# EAGLE design WT12-Teensy3.1 (EAGLE 6.3)
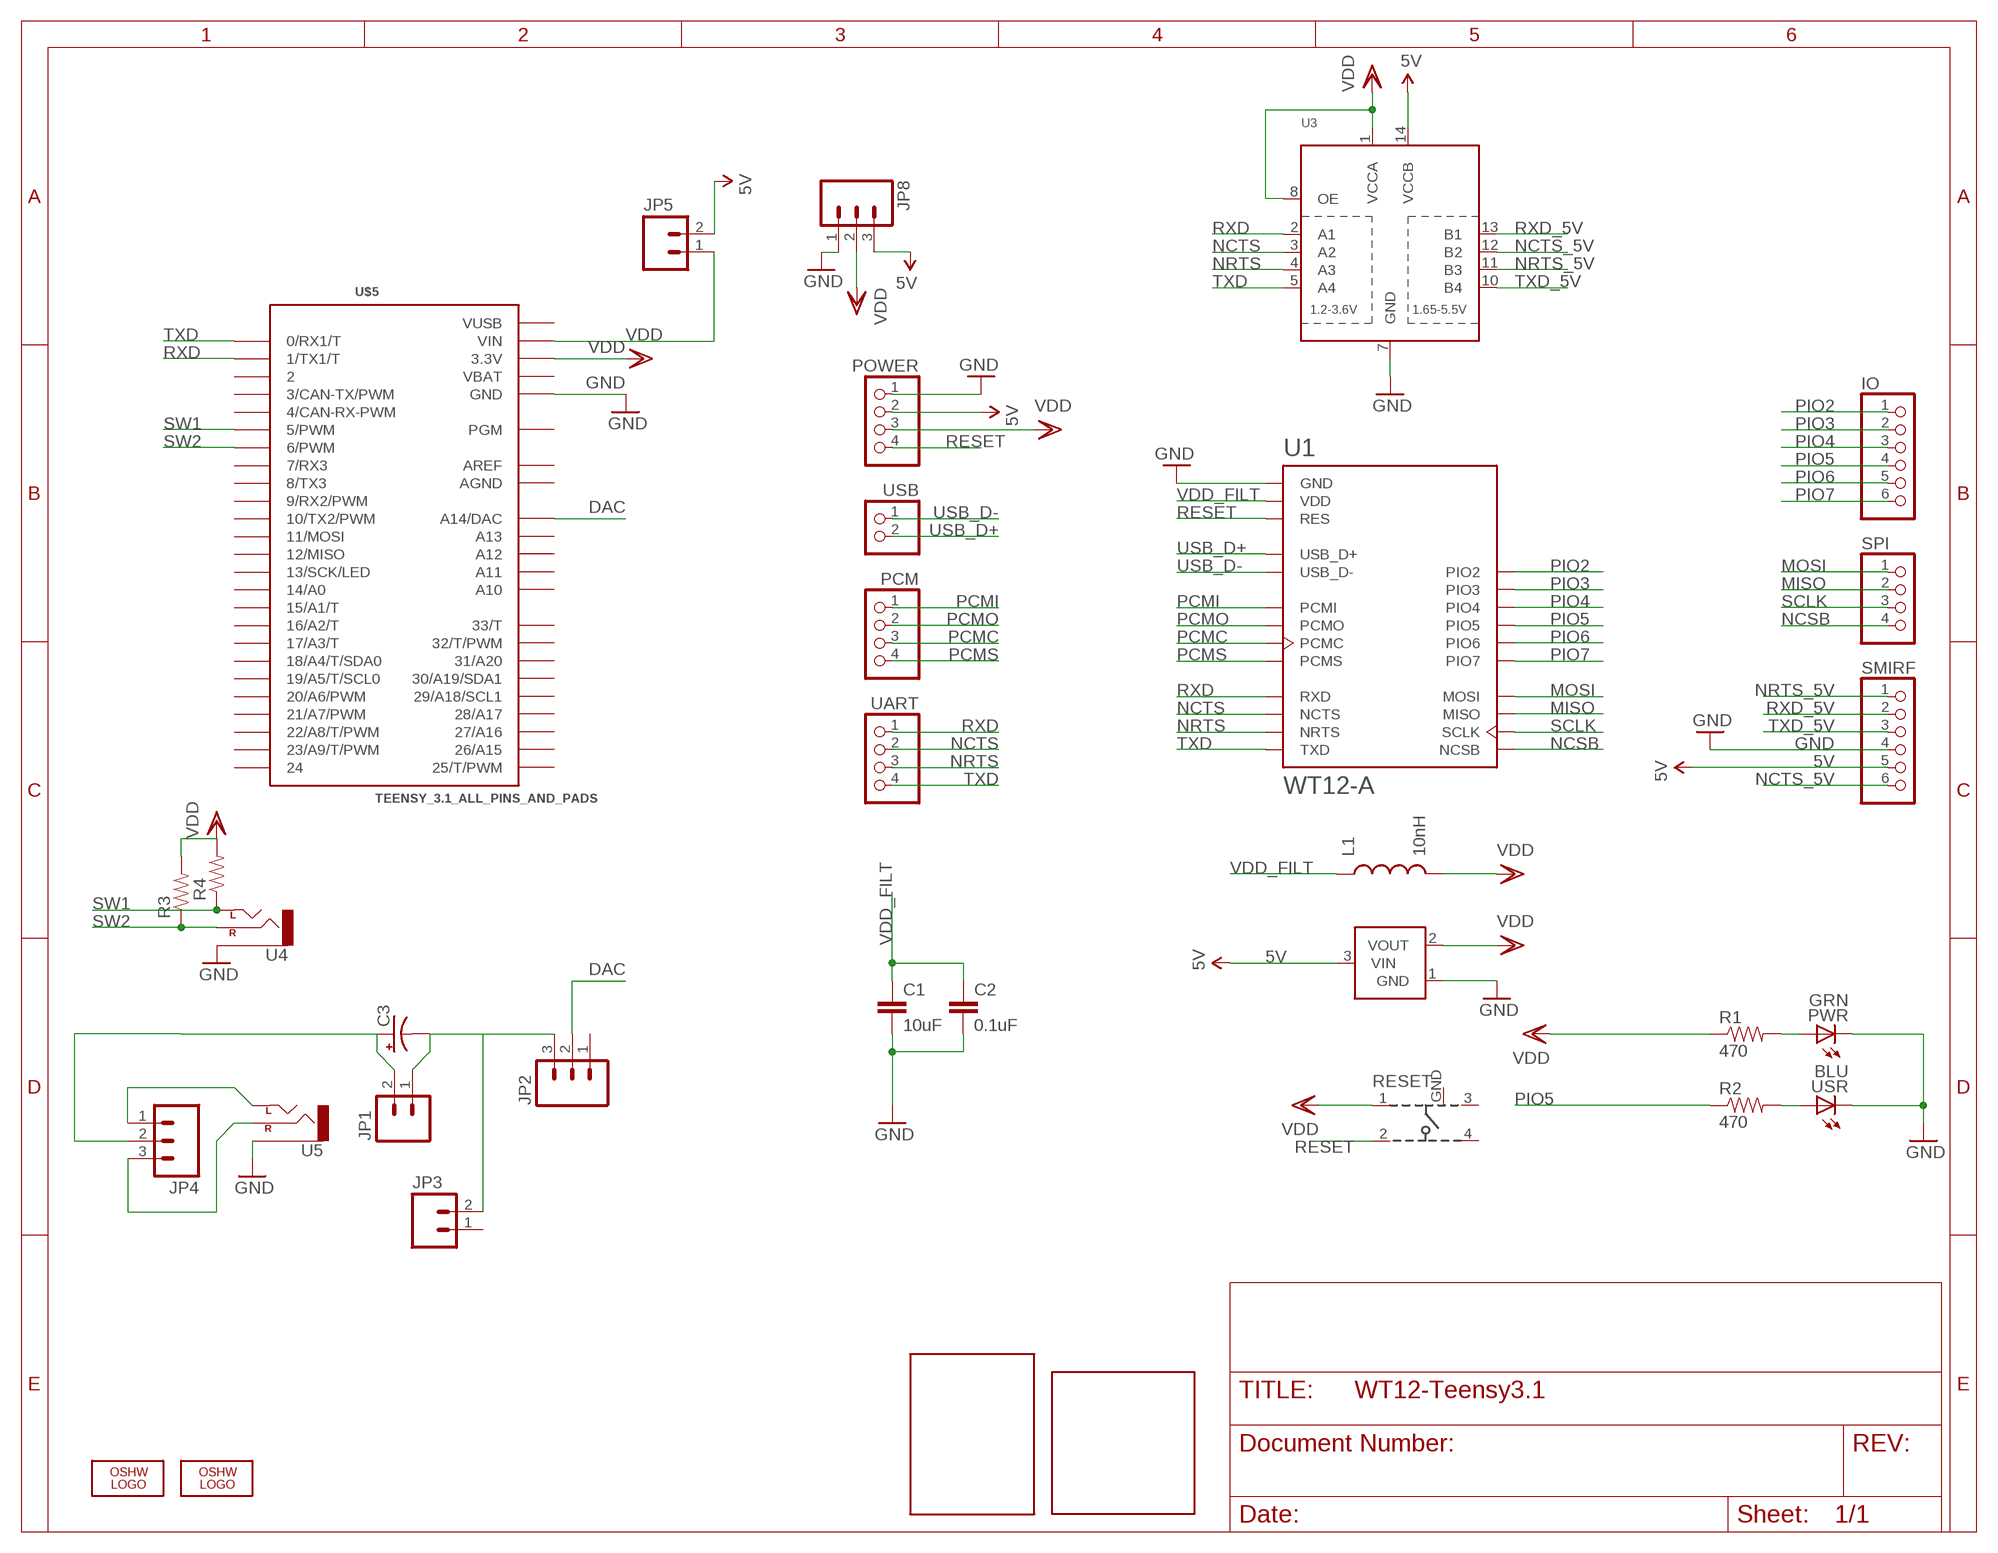
[diagram p0: schematic, sheet 1]

## Parts
C1  10uF  CAP0603-CAP  [0603-CAP]
C2  0.1uF  CAP0603-CAP  [0603-CAP]
C3  CAP_POLPTH1  [CPOL-RADIAL-100UF-25V]
IO  PINHD-1X6  [1X06]
JP1  M02PTH  [1X02]
JP2  M03PTH  [1X03]
JP3  M02PTH  [1X02]
JP4  M03PTH  [1X03]
JP5  M02PTH  [1X02]
JP8  M03PTH  [1X03]
L1  10nH  INDUCTOR0603  [0603]
LOGO1  OSHW_LOGO_FILLX0070-NT  [OSHW_FILLX70_NOTEXT]
LOGO3  OSHW_LOGO_FILLX0070-NT  [OSHW_FILLX70_NOTEXT]
PCM  PINHD-1X4  [1X04]
POWER  PINHD-1X4  [1X04]
PWR  GRN  LEDCHIPLED_0805  [CHIPLED_0805]
R1  470  RESISTOR0603-RES  [0603-RES]
R2  470  RESISTOR0603-RES  [0603-RES]
R3  RESISTOR0603-RES  [0603-RES]
R4  RESISTOR0603-RES  [0603-RES]
RESET  101-IG  [101-IG]
SMIRF  PINHD-1X6  [1X06]
SPI  PINHD-1X4  [1X04]
U1  WT12-A  [WT12-A]
U2  MCP1700  [SOT23-3]
U3  TXB0104PWR  [TSSOP14]
U4  AUDIO-JACKPTH  [AUDIO-JACK]
U5  AUDIO-JACKPTH  [AUDIO-JACK]
U$2  PROTOAREA5X6  [PROTOAREA5X6]
U$5  TEENSY_3.1_ALL_PINS_AND_PADS  [TEENSY_3.1_ALLPINS]
U$6  PROTOAREA  [PROTOAREA]
UART  PINHD-1X4  [1X04]
USB  PINHD-1X2  [1X02]
USR  BLU  LEDCHIPLED_0805  [CHIPLED_0805]

## Nets
5V [power]: JP5.2 JP8.3 POWER.2 SMIRF.5 U2.3(VIN) U3.14(VCCB)
DAC: JP2.2 U$5.A14(A14/DAC)
GND [power]: C1.2 C2.2 JP8.1 POWER.1 PWR.C SMIRF.4 U1.GND U1.GND@2(GND) U1.GND@3(GND) U1.GND@4(GND) U2.1(GND) U3.7(GND) U4.SLEEVE U5.SLEEVE U$5.GND U$5.GND1(GND) U$5.GND2(GND) USR.C
MISO: SPI.2 U1.MISO
MOSI: SPI.1 U1.MOSI
N$1: PWR.A R1.2
N$2: C3.2(-) JP1.1 JP2.3 JP3.2
N$3: R2.2 USR.A
N$4: JP4.1 U5.TIP(LEFT)
N$5: C3.1(+) JP1.2 JP4.2
N$6: JP4.3 U5.RING(RIGHT)
N$7: JP5.1 U$5.VIN
NCSB: SPI.4 U1.NCSB
NCTS: U1.NCTS U3.3(A2) UART.2
NCTS_5V: SMIRF.6 U3.12(B2)
NRTS: U1.NRTS U3.4(A3) UART.3
NRTS_5V: SMIRF.1 U3.11(B3)
PCMC: PCM.3 U1.PCMC
PCMI: PCM.1 U1.PCMI
PCMO: PCM.2 U1.PCMO
PCMS: PCM.4 U1.PCMS
PIO2: IO.1 U1.PIO2
PIO3: IO.2 U1.PIO3
PIO4: IO.3 U1.PIO4
PIO5: IO.4 R2.1 U1.PIO5
PIO6: IO.5 U1.PIO6
PIO7: IO.6 U1.PIO7
RESET: POWER.4 RESET.2 U1.RES
RXD: U1.RXD U3.2(A1) U$5.1(1/TX1/T) UART.1
RXD_5V: SMIRF.2 U3.13(B1)
SCLK: SPI.3 U1.SCLK
SW1: R4.1 U4.TIP(LEFT) U$5.5(5/PWM)
SW2: R3.1 U4.RING(RIGHT) U$5.6(6/PWM)
TXD: U1.TXD U3.5(A4) U$5.0(0/RX1/T) UART.4
TXD_5V: SMIRF.3 U3.10(B4)
USB_D+: U1.USB_D+ USB.2
USB_D-: U1.USB_D- USB.1
VDD [power]: JP8.2 L1.2 POWER.3 R1.1 R3.2 R4.2 RESET.1 U2.2(VOUT) U3.1(VCCA) U3.8(OE) U$5.3.3V U$5.3.3V1(3.3V) U$5.3.3V2(3.3V)
VDD_FILT [power]: C1.1 C2.1 L1.1 U1.VDD U1.VDD@2(VDD)
Unconnected: JP2.1 JP3.1 RESET.3 RESET.4 U$5.2 U$5.3(3/CAN-TX/PWM) U$5.4(4/CAN-RX-PWM) U$5.7(7/RX3) U$5.8(8/TX3) U$5.9(9/RX2/PWM) U$5.10(10/TX2/PWM) U$5.11(11/MOSI) U$5.12(12/MISO) U$5.13(13/SCK/LED) U$5.14/A0 U$5.15/A1(15/A1/T) U$5.16/A2(16/A2/T) U$5.17/A3(17/A3/T) U$5.18/A4(18/A4/T/SDA0) U$5.19/A5(19/A5/T/SCL0) U$5.20/A6(20/A6/PWM) U$5.21/A7(21/A7/PWM) U$5.22/A8(22/A8/T/PWM) U$5.23/A9(23/A9/T/PWM) U$5.24 U$5.25(25/T/PWM) U$5.26(26/A15) U$5.27(27/A16) U$5.28(28/A17) U$5.29(29/A18/SCL1) U$5.30(30/A19/SDA1) U$5.31(31/A20) U$5.32(32/T/PWM) U$5.33(33/T) U$5.A10 U$5.A11 U$5.A12 U$5.A13 U$5.PGM

## Power pins joined to a net without a drawn wire
AGND: U$5.AGND
AREF: U$5.AREF
GND: RESET.GND
VBAT: U$5.VBAT
VUSB: U$5.VUSB

## Library data of the parts
C1 C2 = SparkFun:CAP: Capacitor Standard 0603 ceramic capacitor, and 0.1" leaded capacitor.
C3 = SparkFun-Capacitors:CAP_POL: Capacitor Polarized These are standard SMD and PTH capacitors. Normally 10uF, 47uF, and 100uF in electrolytic and tantalum varieties. Always verify the external diameter of the through hole cap, it varies with capacity, voltage, and manufacturer. The EIA devices should be standard.
IO SMIRF = sf-pinhead:PINHD-1X6: PIN HEADER
JP1 JP3 JP5 = SparkFun-Connectors:M02: Header 2 Standard 2-pin 0.1" header. Use with straight break away headers (SKU : PRT-00116), right angle break away headers (PRT-00553), swiss pins (PRT-00743), machine pins (PRT-00117), and female headers (PRT-00115). Molex polarized connector foot print use with SKU : PRT-08233 with associated crimp pins and housings.
JP2 JP4 JP8 = SparkFun-Connectors:M03: Header 3 Standard 3-pin 0.1" header. Use with straight break away headers (SKU : PRT-00116), right angle break away headers (PRT-00553), swiss pins (PRT-00743), machine pins (PRT-00117), and female headers (PRT-00115). Molex polarized connector foot print use with SKU : PRT-08232 with associated crimp pins and housings.
L1 = SparkFun:INDUCTOR: Inductors Basic Inductor/Choke - 0603 and 1206. Footprints are not proven and vary greatly between part numbers.
LOGO1 LOGO3 = oshw-logo:OSHW_LOGO_FILL
PCM POWER SPI UART = sf-pinhead:PINHD-1X4: PIN HEADER
PWR USR = adafruit:LED: LED OSRAM: - CHIPLED LG R971, LG N971, LY N971, LG Q971, LY Q971, LO R971, LY R971 LH N974, LH R974 LS Q976, LO Q976, LY Q976 LO Q996 - Hyper CHIPLED LW Q18S LB Q993, LB Q99A, LB R99A - SideLED LS A670, LO A670, LY A670, LG A670, LP A670 LB A673, LV A673, LT A673, LW A673 LH A674 LY A675 LS A676, LA A676, LO A676, LY A676, LW A676 LS A679, LY A679, LG A679 - Hyper Micro SIDELED® LS Y876, LA Y876, LO Y876, LY Y876 LT Y87S - SmartLED LW L88C, LW L88S LB L89C, LB L89S, LG L890 LS L89K, LO L89K, LY L89K LS L896, LA L896, LO L896, LY L896 - TOPLED LS T670, LO T670, LY T670, LG T670, LP T670 LSG T670, LSP T670, LSY T670, LOP T670, LYG T670 LG T671, LOG T671, LSG T671 LB T673, LV T673, LT T673, LW T673 LH T674 LS T676, LA T676, LO T676, LY T676, LB T676, LH T676, LSB T676, LW T676 LB T67C, LV T67C, LT T67C, LS T67K, LO T67K, LY T67K, LW E67C LS E67B, LA E67B, LO E67B, LY E67B, LB E67C, LV E67C, LT E67C LW T67C LS T679, LY T679, LG T679 LS T770, LO T770, LY T770, LG T770, LP T770 LB T773, LV T773, LT T773, LW T773 LH T774 LS E675, LA E675, LY E675, LS T675 LS T776, LA T776, LO T776, LY T776, LB T776 LHGB T686 LT T68C, LB T68C - Hyper Mini TOPLED® LB M676 - Mini TOPLED Santana® LG M470 LS M47K, LO M47K, LY M47K Source: http://www.osram.convergy.de/
R1 R2 = SparkFun:RESISTOR: Resistor Basic schematic elements and footprints for 0603, 1206, and PTH resistors.
R3 R4 = SparkFun-Passives:RESISTOR: Resistor Basic schematic elements and footprints for 0603, 1206, and PTH resistors.
RESET = sf-keyglove:101-IG
U1 = sf-bluegiga:WT12: Bluegiga WT12 class 2 Bluetooth 2.1 + EDR module. WT12-A variant has an on-module ceramic chip antenna. WT12-A variant includes keepout/restrict area. Antenna edge of the module should be flush up against the edge of the PCB. See datasheet for variant layout details. The WT12 is a fully integrated Bluetooth 2.1 + EDR, class 2 module combining antenna, Bluetooth radio, and an on-board iWRAP Bluetooth stack. Bluegiga's WT12 constitutes the ideal solution for developers that want to quickly integrate Bluetooth wireless technology into their design without investing several months in Bluetooth radio and stack development. It uses Bluegiga's iWRAP Bluetooth stack, which is an embedded Bluetooth stack implementing 13 different Bluetooth profiles and Apple iAP connectivity. The WT12 combined with iWRAP Bluetooth stack and Bluegiga's excellent technical support designers ensure quick time-to-market and low development costs and risks. http://www.bluegiga.com/en-US/products/bluetooth-classic-modules/wt12-bluetooth--class-2-module https://github.com/jrowberg/sf-oshw Last updated 2014-01-04 by Jeff Rowberg <jeff@rowberg.net>; ANTENNA: On-module ceramic chip antenna
U2 = nonolith:MCP1700: Voltage regulator
U3 = SparkFun-DigitalIC:TXB0104PWR: 4-Bit Bi-Directional Level Shifter 1.2V-3.6V (VCCA) to 1.65V-5.5V (VCCB) bi-directional level shifter with auto direction sensing. Max data rate - VCCA 1.8V: 20Mbps (50ns), VCCA 3.3V: 100Mbps (10ns) Digikey: 296-21929-1-ND (TSSOP) IC-11329
U4 U5 = SparkFun-Connectors:AUDIO-JACK: 3.5mm Audio Jack Simple 3.5mm common PCB mount audio jack. SKU: PRT-08032
U$2 = zunkworks:PROTOAREA5X6
U$5 = Teensy_3_Series_Board_v1.0:TEENSY_3.1_ALL_PINS_AND_PADS: Footprint for Teensy 3.1 board using all pads and all through-holes. Pads need a 2x7 0.1" SMD header.
U$6 = zunkworks:PROTOAREA
USB = sf-pinhead:PINHD-1X2: PIN HEADER

## Net classes
0 default: width 0.152 mm, drill 0.33 mm, clearance 0.152 mm
1 power: width 0.254 mm, drill 0.33 mm, clearance 0.152 mm

## Board
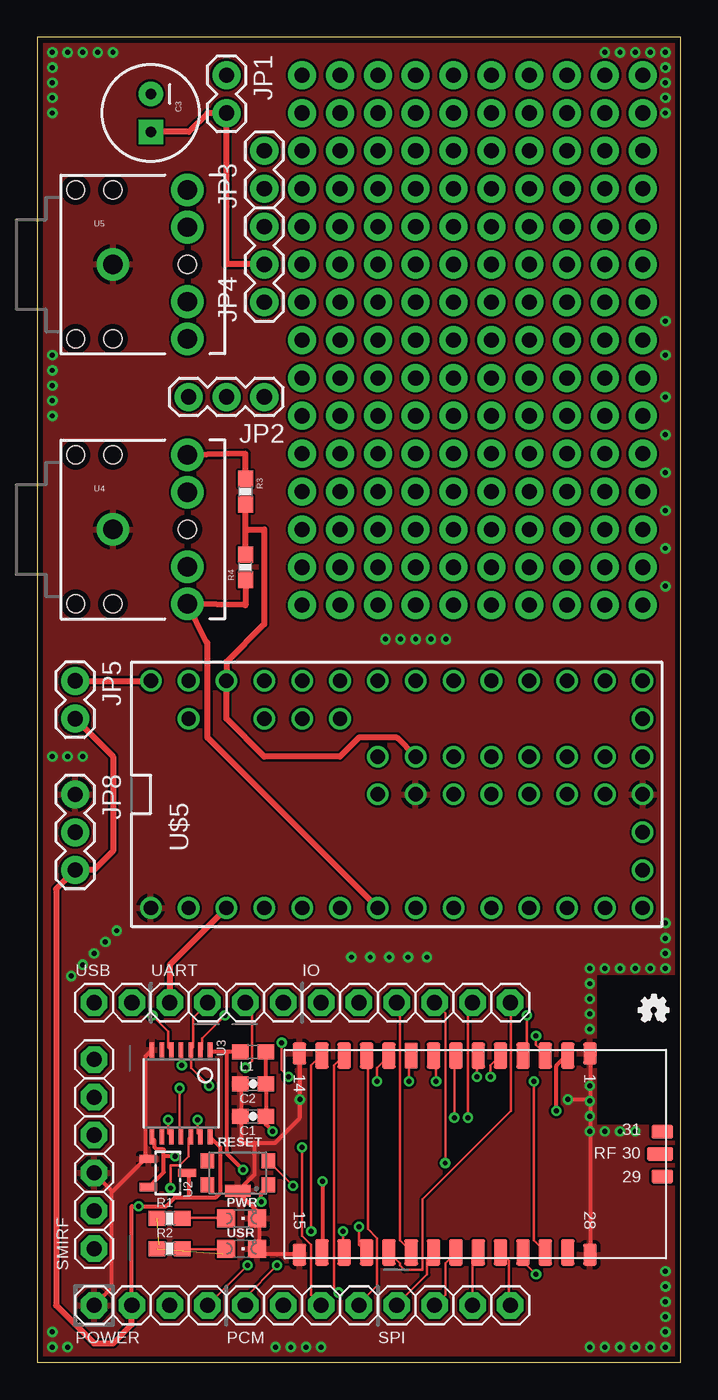
[diagram p1: board, top side]
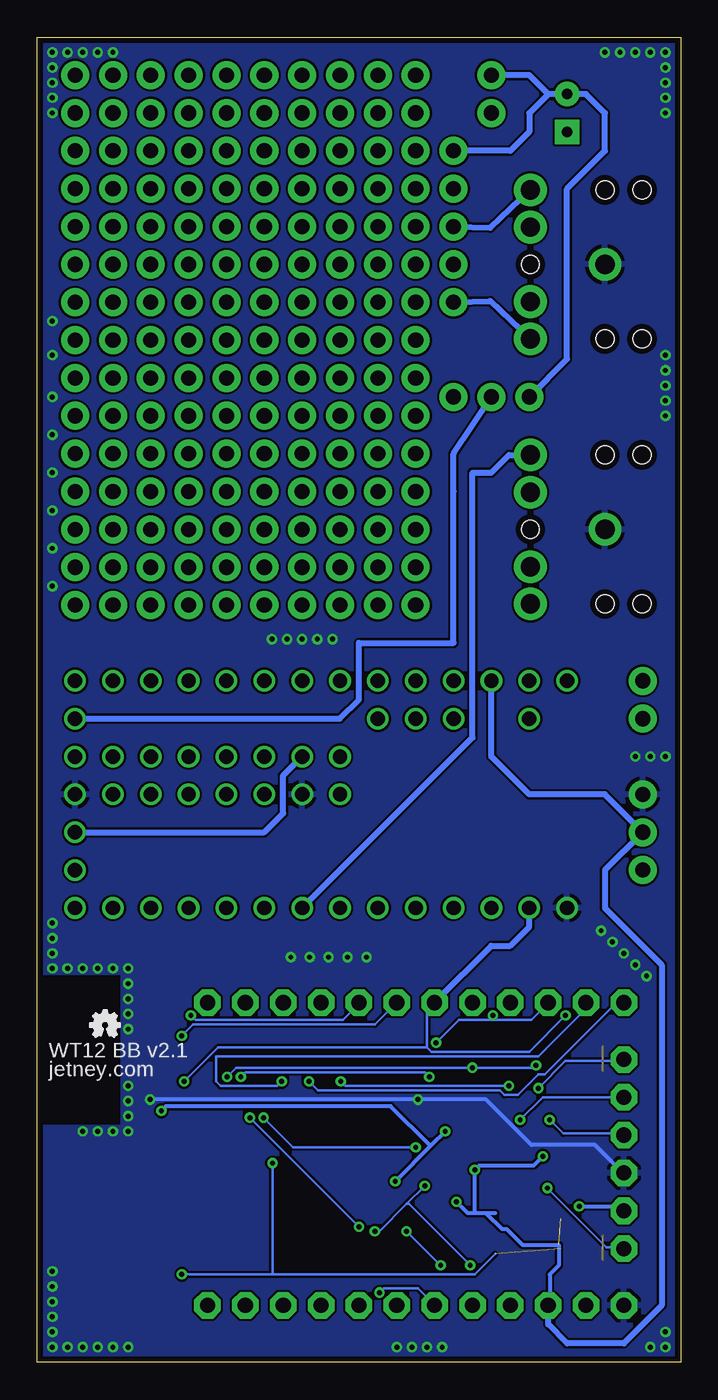
[diagram p2: board, bottom side, seen from below]

Size 43.18 x 88.9 mm. Coordinates in mm from the lower left corner, seen from the top.
Outline: 0,0 43.18,0 43.18,88.9 0,88.9 0,0
Copper layers (1*16): Top 0.0356mm / dielectric 1.5011mm / Bottom 0.0356mm
Design rules "LaenPCBOrder": minimum track width 6mil, minimum drill 13mil, track to track 6mil, track to pad 6mil, pad to pad 6mil, via to via 6mil, smd to smd 6mil, copper to edge 15mil, drill to drill 6mil, minimum pad ring 7mil, minimum via ring 7mil, stop-mask expansion 3mil, vias tented up to drill 0mil, thermal gap 10mil
vRestrict: area 2.5,21.8 to 33,22.9; area 2.5,5.1 to 33,6.1; area 5.1,6.3 to 6.3,21.6; area 12.7,8.4 to 14.2,8.9; area 12.7,10.4 to 14.2,10.9

### Footprints (pad centres in the part's own frame; a part is rotated, then mirrored left to right if it is on the bottom)
0603-CAP = smd 1.1 x 1: 1 -0.85,0; 2 0.85,0
CPOL-RADIAL-100UF-25V = drill 0.7 pad 1.651 square: 1 1.27,0 | drill 0.7 pad 1.651: 2 -1.27,0
1X06 = drill 1.016 pad 1.778 octagon: 1 -6.35,0; 2 -3.81,0; 3 -1.27,0; 4 1.27,0; 5 3.81,0; 6 6.35,0
1X02 = drill 1.016 pad 1.88: 1 0,0; 2 2.54,0
1X03 = drill 1.016 pad 1.88: 1 0,0; 2 2.54,0; 3 5.08,0
0603 = smd 1.1 x 1: 1 -0.85,0; 2 0.85,0
1X04 = drill 1.016 pad 1.778 octagon: 1 -3.81,0; 2 -1.27,0; 3 1.27,0; 4 3.81,0
CHIPLED_0805 = smd 1.2 x 1.2: A 0,-1.05; C 0,1.05
0603-RES = smd 1.1 x 1: 1 -0.85,0; 2 0.85,0
101-IG = smd 0.9 x 1: 1 -2.05,0.8; 2 -2.05,-0.8; 3 2.05,0.8; 4 2.05,-0.8 | smd 1.7 x 0.8: GND 0,1.2
WT12-A = smd 1.478 x 0.914: GND -6.75,7.7; GND@2 -6.75,-11.8; GND@3 6.75,-11.8; GND@4 6.75,7.7 | smd 1.778 x 0.914: MISO 6.6,0.2; MOSI 6.6,1.7; NC 6.6,6.2; NCSB 6.6,-2.8; NCTS -6.6,-5.8; NRTS -6.6,1.7; PCMC -6.6,-8.8; PCMI -6.6,-7.3; PCMO -6.6,-1.3; PCMS -6.6,-10.3; PIO2 -6.6,4.7; PIO3 -6.6,3.2; PIO4 6.6,-4.3; PIO5 6.6,3.2; PIO6 6.6,-7.3; PIO7 6.6,-5.8; RES 6.6,-8.8; RXD -6.6,0.2; SCLK 6.6,-1.3; TXD 6.6,4.7; USB_D+ -6.6,-2.8; USB_D- -6.6,-4.3; VDD -6.6,6.2; VDD@2 6.6,-10.3 | smd 0.914 x 1.778: RF 0,12.4 | smd 0.914 x 1.478: RFGND 1.5,12.55; RFGND@2 -1.5,12.55
SOT23-3 = smd 0.55 x 1.2: 1 0.95,1.3; 2 -0.95,1.3; 3 0,-1.3
TSSOP14 = smd 0.305 x 0.991: 1 -1.95,-2.918; 2 -1.3,-2.918; 3 -0.65,-2.918; 4 0,-2.918; 5 0.65,-2.918; 6 1.3,-2.918; 7 1.95,-2.918; 8 1.95,2.918; 9 1.3,2.918; 10 0.65,2.918; 11 0,2.918; 12 -0.65,2.918; 13 -1.3,2.918; 14 -1.95,2.918
AUDIO-JACK = drill 1.3 pad 2.184: RING 5,5; RSH 5,2.5; SLEEVE 0,0; TIP 5,-5; TSH 5,-2.5 | hole 1.2: 0,5; -2.5,5; -2.5,-5; 0,-5; 5,0
PROTOAREA5X6 = drill 1.016 pad 1.88: P$1 -2.54,1.27; P$2 -5.08,1.27; P$3 -2.54,11.43; P$4 -5.08,11.43; P$5 0,1.27; P$6 0,-1.27; P$7 -2.54,-1.27; P$8 -5.08,-1.27; P$9 0,11.43; P$10 0,8.89; P$11 -2.54,8.89; P$12 -5.08,8.89; P$13 -5.08,-3.81; P$14 -2.54,-3.81; P$15 0,-3.81; P$16 0,-6.35; P$17 -2.54,-6.35; P$18 -5.08,-6.35; P$19 -5.08,6.35; P$20 -2.54,6.35; P$21 0,6.35; P$22 0,3.81; P$23 -2.54,3.81; P$24 -5.08,3.81; P$25 2.54,11.43; P$26 2.54,8.89; P$27 2.54,6.35; P$28 2.54,1.27; P$29 2.54,-1.27; P$30 2.54,-3.81; P$31 2.54,-6.35; P$32 2.54,-8.89; P$33 0,-8.89; P$34 -2.54,-8.89; P$35 -5.08,-8.89; P$36 2.54,3.81; P$37 5.08,11.43; P$38 5.08,8.89; P$39 5.08,6.35; P$40 5.08,3.81; P$53 5.08,1.27; P$54 5.08,-1.27; P$55 5.08,-3.81; P$56 5.08,-6.35; P$57 5.08,-8.89; P$58 5.08,-11.43; P$59 2.54,-11.43; P$60 0,-11.43; P$61 -2.54,-11.43; P$62 -5.08,-11.43
TEENSY_3.1_ALLPINS = drill 0.965: 0 -7.62,15.24; 1 -7.62,12.7; 2 -7.62,10.16; 3 -7.62,7.62; 3.3V 7.62,12.7; 3.3V1 -2.54,-15.24; 3.3V2 2.54,0; 4 -7.62,5.08; 5 -7.62,2.54; 6 -7.62,0; 7 -7.62,-2.54; 8 -7.62,-5.08; 9 -7.62,-7.62; 10 -7.62,-10.16; 11 -7.62,-12.7; 12 -7.62,-15.24; 13 7.62,-15.24; 14/A0 7.62,-12.7; 15/A1 7.62,-10.16; 16/A2 7.62,-7.62; 17/A3 7.62,-5.08; 18/A4 7.62,-2.54; 19/A5 7.62,0; 20/A6 7.62,2.54; 21/A7 7.62,5.08; 22/A8 7.62,7.62; 23/A9 7.62,10.16; 24 0,-2.54; 25 0,-5.08; 26 0,-7.62; 27 0,-10.16; 28 0,-12.7; 29 2.54,-12.7; 30 2.54,-10.16; 31 2.54,-7.62; 32 2.54,-5.08; 33 2.54,-2.54; A10 5.08,7.62; A11 5.08,5.08; A12 0,2.54; A13 2.54,2.54; A14 5.08,-15.24; AGND 7.62,15.24; AREF 5.08,10.16; GND -7.62,17.78; GND1 0,-15.24; GND2 0,0; PGM 2.54,-15.24; VBAT -5.08,-15.24; VIN 7.62,17.78; VUSB 5.08,15.24
PROTOAREA = drill 1.016 pad 1.88: P$1 3.81,1.27; P$2 1.27,1.27; P$3 -1.27,1.27; P$4 -3.81,1.27; P$5 6.35,1.27; P$6 6.35,-1.27; P$7 3.81,-1.27; P$8 1.27,-1.27; P$9 -1.27,-1.27; P$10 -3.81,-1.27; P$11 -3.81,-3.81; P$12 -1.27,-3.81; P$13 1.27,-3.81; P$14 3.81,-3.81; P$15 6.35,-3.81; P$16 6.35,-6.35; P$17 3.81,-6.35; P$18 1.27,-6.35; P$19 -1.27,-6.35; P$20 -3.81,-6.35; P$21 -3.81,3.81; P$22 -1.27,3.81; P$23 1.27,3.81; P$24 3.81,3.81; P$25 6.35,3.81; P$26 8.89,6.35; P$27 8.89,3.81; P$28 8.89,1.27; P$29 8.89,-1.27; P$30 8.89,-3.81; P$31 8.89,-6.35; P$32 8.89,-8.89; P$33 6.35,-8.89; P$34 3.81,-8.89; P$35 1.27,-8.89; P$36 -1.27,-8.89; P$37 -3.81,-8.89; P$38 -6.35,-8.89; P$39 -6.35,-6.35; P$40 -6.35,-3.81; P$41 -6.35,-1.27; P$42 -6.35,1.27; P$43 -6.35,3.81; P$44 -6.35,6.35; P$45 -3.81,6.35; P$46 -1.27,6.35; P$47 1.27,6.35; P$48 3.81,6.35; P$49 6.35,6.35; P$50 11.43,8.89; P$51 11.43,6.35; P$52 11.43,3.81; P$53 11.43,1.27; P$54 11.43,-1.27; P$55 11.43,-3.81; P$56 11.43,-6.35; P$57 11.43,-8.89; P$58 11.43,-11.43; P$59 8.89,-11.43; P$60 6.35,-11.43; P$61 3.81,-11.43; P$62 1.27,-11.43; P$63 -1.27,-11.43; P$64 -3.81,-11.43; P$65 -6.35,-11.43; P$66 -8.89,-11.43; P$67 -8.89,-8.89; P$68 -8.89,-6.35; P$69 -8.89,-3.81; P$70 -8.89,-1.27; P$71 -8.89,1.27; P$72 -8.89,3.81; P$73 -8.89,6.35; P$74 -8.89,8.89; P$75 -6.35,8.89; P$76 -3.81,8.89; P$77 -1.27,8.89; P$78 1.27,8.89; P$79 3.81,8.89; P$80 6.35,8.89; P$81 8.89,8.89; P$82 11.43,11.43; P$83 -8.89,11.43; P$84 -6.35,11.43; P$85 -3.81,11.43; P$86 -1.27,11.43; P$87 1.27,11.43; P$88 3.81,11.43; P$89 6.35,11.43; P$90 8.89,11.43; P$91 -11.43,-11.43; P$92 -11.43,-8.89; P$93 -11.43,-6.35; P$94 -11.43,-3.81; P$95 -11.43,-1.27; P$96 -11.43,1.27; P$97 -11.43,3.81; P$98 -11.43,6.35; P$99 -11.43,8.89; P$100 -11.43,11.43
1X02' = drill 1.016 pad 1.778 octagon: 1 -1.27,0; 2 1.27,0

### Placement (x,y rotation side)
C1  14.48,16.51 180 top
C2  14.48,18.67 180 top
C3  7.62,83.82 270 top
IO  25.4,24.13 0 top
JP1  12.7,86.36 270 top
JP2  15.24,64.77 180 top
JP3  15.24,78.74 90 top
JP4  15.24,71.12 90 top
JP5  2.54,45.72 270 top
JP8  2.54,38.1 270 top
L1  14.48,20.83 180 top
LOGO1  40.39,22.86 0 top
LOGO3  39.62,21.84 0 bottom
PCM  17.78,3.81 180 top
POWER  7.62,3.81 0 top
PWR  13.72,9.65 270 top
R1  8.89,9.65 0 top
R2  8.89,7.62 0 top
R3  13.97,58.42 270 top
R4  13.97,53.34 90 top
RESET  13.46,12.7 180 top
SMIRF  3.81,13.97 270 top
SPI  27.94,3.81 180 top
U1  29.4,13.97 270 top
U2  8.76,12.7 90 top
U3  9.65,18.03 180 top
U4  5.08,55.88 0 top
U5  5.08,73.66 0 top
U$2  29.21,81.28 90 top
U$5  25.4,38.1 90 top
U$6  29.21,62.23 0 top
UART  12.7,24.13 0 top
USB  [1X02']  5.08,24.13 0 top
USR  13.72,7.62 270 top

### Tracks (layer width: path | path; a pad name or v marks a point on that pad's centre or on a via)
5V  (via drill 0.33)
  Top 0.254: 10.16,11.07 11.99,11.07 12.29,11.38 12.29,14.43 11.68,15.04 U3.14 | 10.16,11.07 10.16,12.6 U2.3 | 10.16,11.07 9.25,11.07 8.64,10.46 v6.81,10.46 6.35,10.46 POWER.2
  Top 0.406: POWER.2 6.35,2.54 5.08,1.27 3.81,1.27 1.27,3.81 1.27,31.75 JP8.3 3.81,33.02 5.08,34.29 5.08,40.64 JP5.2
  Bottom 0.254: v6.81,10.46 4.22,10.46 3.91,10.16 SMIRF.5
DAC
  Bottom 0.406: U$5.A14 22.86,43.18 21.59,44.45 21.59,48.26 15.24,48.26 15.24,58.42 15.24,60.96 JP2.2
GND  (via drill 0.33)
  Top 0.254: C2.2 13.66,18.54 13.66,16.56 C1.2 13.66,16.41 13.66,14.73 14.58,14.73 | 17.63,20.68 v17.63,17.63 17.63,16.41 15.95,14.73 14.58,14.73 | 17.48,7.26 14.88,7.26 14.88,7.57 USR.C 14.88,7.72 14.88,9.55 PWR.C 14.73,9.7 14.73,10.16 13.51,11.38 RESET.GND 13.51,11.53 14.58,12.6 14.58,14.73 | 37.13,20.68 37.13,17.63 | 37.13,17.63 37.13,7.26 | U3.7 7.57,20.83 7.26,20.52 7.26,13.82 7.42,13.66 U2.1 | 7.57,13.66 U2.1 | POWER.1 4.98,4.98 4.98,11.38 | 4.98,11.38 4.98,11.53 SMIRF.4 | 4.98,11.38 7.26,13.66 U2.1 | v35.61,17.63 37.13,17.63
  Bottom 0.254: v35.61,17.63 v17.63,17.63 13.06,17.63 10.01,14.58 5.74,14.58 3.91,12.75 SMIRF.4
  other vias: 37.08,15.49 37.08,16.51 37.08,17.53 37.08,18.54 37.08,22.35 37.08,23.37 37.08,24.38 38.1,15.49 39.12,15.49 40.13,15.49 42.16,3.05 41.15,1.02 40.13,1.02 42.16,4.06 42.16,5.08 37.08,25.4 37.08,26.42 38.1,26.42 39.12,26.42 40.13,26.42 41.15,26.42 42.16,26.42 42.16,27.43 42.16,28.45 42.16,29.46 42.16,2.03 42.16,1.02 39.12,1.02 38.1,1.02 37.08,1.02 42.16,6.1 1.02,1.02 2.03,1.02 1.02,2.03 16,1.02 17.02,1.02 18.03,1.02 19.05,1.02 21.08,27.18 22.35,27.18 23.62,27.18 24.89,27.18 26.16,27.18 42.16,87.88 42.16,86.87 42.16,85.85 42.16,84.84 42.16,83.82 41.15,87.88 40.13,87.88 39.12,87.88 38.1,87.88 1.02,87.88 2.03,87.88 3.05,87.88 4.06,87.88 5.08,87.88 1.02,86.87 1.02,85.85 1.02,84.84 1.02,83.82 1.02,67.56 1.02,66.55 1.02,65.53 1.02,64.52 1.02,63.5 23.37,48.51 24.38,48.51 25.4,48.51 26.42,48.51 27.43,48.51 42.16,67.56 42.16,64.77 42.16,62.23 42.16,59.69 42.16,57.15 42.16,54.61 42.16,52.07 42.16,69.85 1.02,40.64 2.03,40.64 3.05,40.64 2.29,25.91 3.05,26.67 3.81,27.43 4.57,28.19 5.33,28.96
  pour Top: 0,88.9 43.18,88.9 43.18,0 0,0
  pour Bottom: 0,88.9 43.18,88.9 43.18,0 0,0
MISO
  Top 0.152: SPI.2 29.21,6.96 29.52,7.26 U1.MISO
MOSI
  Top 0.152: SPI.1 31.65,3.91 31.65,6.81 31.19,7.26 U1.MOSI
N$1
  Top 0.152: R1.2 9.86,9.7 12.6,9.7 PWR.A
N$2
  Bottom 0.406: JP2.3 7.62,67.31 7.62,78.74 5.08,81.28 5.08,83.82 6.35,85.09 C3.2 | C3.2 8.89,85.09 | 8.89,85.09 10.16,86.36 JP1.1 | C3.2 8.89,85.09 | 8.89,85.09 10.16,83.82 10.16,82.55 11.43,81.28 JP3.2
N$3
  Top 0.152: R2.2 9.86,7.57 12.6,7.57 USR.A
N$4
  Bottom 0.406: JP4.1 12.78,71.2 U5.TIP
N$5
  Top 0.406: JP4.2 12.7,73.66 12.7,78.74 12.7,81.28 JP1.2 11.43,83.82 10.16,82.55 C3.1
N$6
  Bottom 0.406: JP4.3 12.78,76.12 U5.RING
N$7
  Top 0.406: JP5.1 U$5.VIN
NCSB
  Top 0.152: SPI.4 24.18,3.91 26.16,5.89 26.16,6.96 26.47,7.26 U1.NCSB
NCTS  (via drill 0.33)
  Top 0.152: UART.2 11.38,24.03 10.46,23.11 10.46,21.13 10.31,20.98 U3.3 10.31,20.83 10.31,19.76 v11.53,18.54 | v22.81,18.85 22.81,19.76 23.57,20.52 U1.NCTS
  Bottom 0.152: v22.81,18.85 22.5,18.54 v11.53,18.54
NCTS_5V  (via drill 0.33)
  Top 0.152: v8.94,11.68 8.94,13.21 9.55,13.21 10.16,13.82 10.16,15.04 U3.12
  Bottom 0.152: v8.94,11.68 4.98,7.72 3.91,7.72 SMIRF.6
NRTS  (via drill 0.33)
  Top 0.152: v9.7,19.91 9.7,20.83 U3.4 | v13.97,19.76 14.43,20.22 14.43,23.57 13.97,24.03 UART.3 | v30.43,19.15 30.43,19.91 31.04,20.52 U1.NRTS
  Bottom 0.152: v9.7,19.91 9.86,19.76 v13.97,19.76 29.82,19.76 v30.43,19.15
NRTS_5V  (via drill 0.33)
  Top 0.152: v9.55,18.39 9.55,15.19 U3.11
  Bottom 0.152: v9.55,18.39 7.72,20.22 3.91,20.22 SMIRF.1
PCMC  (via drill 0.33)
  Top 0.152: v20.22,4.67 19.91,4.98 19.91,19.91 20.52,20.52 U1.PCMC
  Bottom 0.152: v20.22,4.67 19.91,4.98 17.63,4.98 16.56,3.91 PCM.3
PCMI
  Top 0.152: PCM.1 21.59,3.91 22.81,5.13 22.81,8.33 22.2,8.94 22.2,20.52 U1.PCMI
PCMO  (via drill 0.33)
  Top 0.152: v27.99,16.41 27.99,20.52 U1.PCMO | v17.78,14.43 17.78,8.48 18.39,7.87 18.39,4.52 19,3.91 PCM.2
  Bottom 0.152: v27.99,16.41 26.01,14.43 v17.78,14.43
PCMS  (via drill 0.33)
  Top 0.152: v18.39,8.79 18.39,19.91 19,20.52 U1.PCMS | v16.1,6.5 13.97,4.37 PCM.4
  Bottom 0.152: v16.1,6.5 v18.39,8.79
PIO2  (via drill 0.33)
  Top 0.152: v33.48,21.89 33.48,21.29 34.09,20.68 U1.PIO2
  Bottom 0.152: v33.48,21.89 32.72,22.66 20.52,22.66 IO.1
PIO3  (via drill 0.33)
  Top 0.152: v32.87,23.27 32.87,20.83 32.72,20.68 U1.PIO3
  Bottom 0.152: v32.87,23.27 32.56,22.96 22.66,22.96 21.59,24.03 IO.2
PIO4
  Top 0.152: IO.3 24.18,24.03 24.33,23.88 24.33,8.18 25.09,7.42 U1.PIO4
PIO5  (via drill 0.33)  (1 unrouted)
  Top 0.152: v33.48,5.89 32.72,6.66 32.72,7.26 U1.PIO5 | IO.4 27.38,23.42 v27.38,13.36
  Bottom 0.152: 12.45,7.26 13.82,5.89 27.38,5.89 | v33.48,5.89 27.38,5.89 | 27.38,5.89 v27.38,13.36
PIO6  (via drill 0.33)
  Top 0.152: v21.59,9.09 21.59,7.87 22.05,7.42 U1.PIO6 | v28.91,16.41 28.91,23.72 29.21,24.03 IO.5
  Bottom 0.152: v28.91,16.41 v21.59,9.09
PIO7
  Top 0.152: IO.6 31.8,24.03 31.8,16.87 25.86,10.92 25.86,6.2 24.64,6.2 24.33,6.5 24.33,6.66 23.72,7.26 U1.PIO7
RESET  (via drill 0.33)
  Top 0.152: v17.17,11.84 15.65,13.36 RESET.2 | v20.52,8.79 20.52,7.42 U1.RES | v14.12,6.5 POWER.4
  Bottom 0.152: 18.39,10.62 20.22,8.79 v20.52,8.79 | 18.39,10.62 v17.17,11.84 | v14.12,6.5 18.24,10.62 18.39,10.62
RXD  (via drill 0.33)
  Top 0.152: v12.6,23.27 11.07,21.74 11.07,20.98 U3.2 | v29.52,19.15 29.52,20.52 U1.RXD | v16.87,19.15 16.41,19.61 v16.41,21.44
  Top 0.406: U$5.1 8.89,26.67 UART.1
  Bottom 0.152: 12.29,22.96 v12.6,23.27 | 12.29,22.96 10.01,22.96 8.94,24.03 UART.1 | v29.52,19.15 29.21,19.46 17.17,19.46 v16.87,19.15 | v16.41,21.44 14.88,22.96 12.29,22.96
RXD_5V  (via drill 0.33)
  Top 0.152: v10.77,16.26 10.77,15.34 10.92,15.19 U3.13
  Bottom 0.152: v10.77,16.26 9.25,17.78 SMIRF.2
SCLK
  Top 0.152: SPI.3 27.38,4.52 27.38,6.66 27.99,7.26 U1.SCLK
SW1
  Top 0.406: U$5.5 11.43,41.91 11.43,48.26 11.35,48.34 U4.TIP 13.97,50.8 R4.1
SW2
  Top 0.406: R3.1 13.97,60.96 U4.RING
  Bottom 0.406: U$5.6 13.97,41.91 13.97,59.69 12.7,59.69 11.51,60.88 U4.RING
TXD  (via drill 0.33)
  Top 0.152: v7.72,23.27 8.79,22.2 8.79,21.13 8.94,20.98 U3.5 | v33.33,18.85 33.33,8.18 34.09,7.42 U1.TXD
  Bottom 0.152: v7.72,23.27 10.16,20.83 16.71,20.83 17.02,21.13 | 17.02,21.13 17.02,24.03 16.56,24.03 UART.4 | v33.33,18.85 31.04,21.13 17.02,21.13
  Bottom 0.406: UART.4 12.7,27.94 11.43,27.94 10.16,29.21 U$5.0
TXD_5V  (via drill 0.33)
  Top 0.152: v8.79,16.26 8.79,15.34 8.94,15.19 U3.10
  Bottom 0.152: v8.79,16.26 7.87,15.34 3.91,15.34 SMIRF.3
USB_D+  (via drill 0.33)
  Top 0.152: v26.77,18.85 26.77,20.37 26.62,20.52 U1.USB_D+
  Bottom 0.152: v26.77,18.85 27.08,18.54 30.89,18.54 31.19,18.85 31.19,20.52 9.55,20.52 6.35,23.72 USB.2
USB_D-  (via drill 0.33)
  Top 0.152: v24.94,18.85 24.94,20.37 25.09,20.52 U1.USB_D-
  Bottom 0.152: v24.94,18.85 24.33,18.24 12.14,18.24 11.84,17.93 10.92,17.93 9.55,19.3 9.09,19.3 4.37,24.03 3.91,24.03 USB.1
VDD  (via drill 0.33)  (1 unrouted)
  Top 0.254: 8.48,13.82 8.48,12.75 7.57,11.84 U2.2 | 8.48,13.82 8.48,14.28 8.03,14.28 7.87,14.43 7.87,14.88 7.72,15.04 U3.8 | L1.2 12.75,20.83 | 12.75,20.83 11.68,20.83 U3.1 | v15.04,10.77 15.04,11.38 15.49,11.84 RESET.1 | 12.75,20.83 12.75,13.97 v13.82,12.9 | v9.25,13.82 8.48,13.82
  Top 0.406: U$5.3.3V2 24.13,41.91 21.59,41.91 20.32,40.64 15.24,40.64 12.7,43.18 U$5.3.3V 12.7,46.99 15.24,49.53 15.24,55.88 13.97,55.88 | 13.97,55.88 R4.2 13.97,55.88 | 13.97,55.88 R3.2
  Bottom 0.254: v15.04,10.77 14.28,10.01 13.82,10.01 | 12.45,10.01 13.06,10.01 | 13.06,10.01 13.82,10.01 | 13.82,10.01 v13.82,12.9 13.51,13.21 9.86,13.21 v9.25,13.82 | 13.06,10.01 11.99,8.94 11.68,8.94 10.62,7.87 8.18,7.87 8.18,6.5 8.79,5.89 8.79,3.91 POWER.3
  Bottom 0.406: POWER.3 8.89,2.54 7.62,1.27 3.81,1.27 1.27,3.81 1.27,26.67 5.08,30.48 5.08,33.02 JP8.2 5.08,38.1 10.16,38.1 12.7,40.64 U$5.3.3V | U$5.3.3V1 27.94,35.56 26.67,36.83 26.67,39.37 U$5.3.3V2
VDD_FILT  (via drill 0.33)
  Top 0.254: L1.1 15.34,20.83 15.34,18.69 C2.1 15.34,18.54 15.34,16.56 C1.1 15.34,16.41 15.34,15.95 v15.8,15.49 | v19.15,12.14 19.15,7.42 U1.VDD@2 | v34.85,16.87 34.85,19.91 35.46,20.52 U1.VDD
  Bottom 0.254: v15.8,15.49 16.79,14.5 | 16.79,14.5 v19.15,12.14 | v34.85,16.87 34.54,17.17 19.46,17.17 16.79,14.5

### Text on the board
bPlace: WT12 BB v2.1 | jetney.com
tDocu: D- D+ | RXD CTS RTS TXD | P2 P3 P4 P5 P6 P7 | RTS RXD TXD GND VCC CTS | Bluegiga / WT12-A | GND 3V3 RES SYN CLK OUT CSB SCK | 5V | IN | MISO | MOSI
bDocu: RTS RXD TXD GND VCC CTS | PWR | PIO5